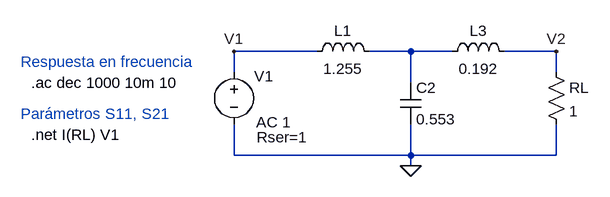
[diagram p0: schematic circuito_normalizado.asc]
circuito_normalizado.asc, the LTspice schematic file:
Version 4
SHEET 1 880 680
WIRE 208 96 80 96
WIRE 352 96 288 96
WIRE 416 96 352 96
WIRE 576 96 496 96
WIRE 80 128 80 96
WIRE 576 128 576 96
WIRE 352 144 352 96
WIRE 80 256 80 208
WIRE 352 256 352 208
WIRE 352 256 80 256
WIRE 576 256 576 208
WIRE 576 256 352 256
WIRE 352 272 352 256
FLAG 352 272 0
FLAG 576 96 V2
FLAG 80 96 V1
SYMBOL ind 192 112 R270
WINDOW 0 32 56 VTop 2
WINDOW 3 5 56 VBottom 2
SYMATTR InstName L1
SYMATTR Value 1.255
SYMATTR SpiceLine Rser=0
SYMBOL ind 400 112 R270
WINDOW 0 32 56 VTop 2
WINDOW 3 5 56 VBottom 2
SYMATTR InstName L3
SYMATTR Value 0.192
SYMATTR SpiceLine Rser=0
SYMBOL cap 336 144 R0
SYMATTR InstName C2
SYMATTR Value 0.553
SYMBOL res 560 112 R0
SYMATTR InstName RL
SYMATTR Value 1
SYMBOL voltage 80 112 R0
WINDOW 0 31 22 Left 2
WINDOW 123 34 93 Left 2
WINDOW 39 35 116 Left 2
SYMATTR InstName V1
SYMATTR Value2 AC 1
SYMATTR SpiceLine Rser=1
SYMATTR Value ""
TEXT -232 144 Left 2 !.ac dec 1000 10m 10
TEXT -232 224 Left 2 !.net I(RL) V1
TEXT -248 112 Left 2 ;Respuesta en frecuencia
TEXT -248 192 Left 2 ;Parámetros S11, S21

The netlist it stands for:
* circuito_normalizado.asc
L1 V1 N001 1.255 Rser=0
L3 N001 V2 0.192 Rser=0
C2 N001 0 0.553
RL V2 0 1
V1 V1 0 AC 1 Rser=1
.ac dec 1000 10m 10
.net I(RL) V1
* Respuesta en frecuencia
* Parámetros S11, S21
.backanno
.end

* Results of the author's LTspice run, read from the files saved beside the schematic
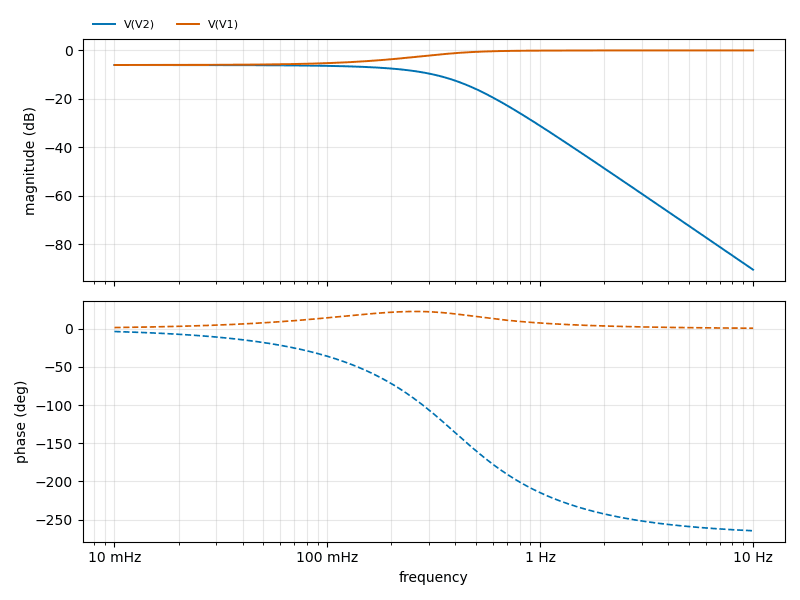
[diagram p1: AC Analysis of circuito_normalizado.asc, plotted from the saved traces]
* AC Analysis, 1 run:
*   V(V2): -6.02 dB at 10 mHz, -90.39 dB at 10 Hz, peak -6.02 dB at 10 mHz, 3 dB below the peak at 279.5 mHz
*   V(V1): -6.01 dB at 10 mHz, -0.00 dB at 10 Hz, peak -0.00 dB at 10 Hz, 3 dB below the peak at 238.3 mHz